# EAGLE design GCLora (EAGLE 6.3)
COMPANY: ADAFRUIT INDUSTRIES; DRAWN: KTOWN; REV: B
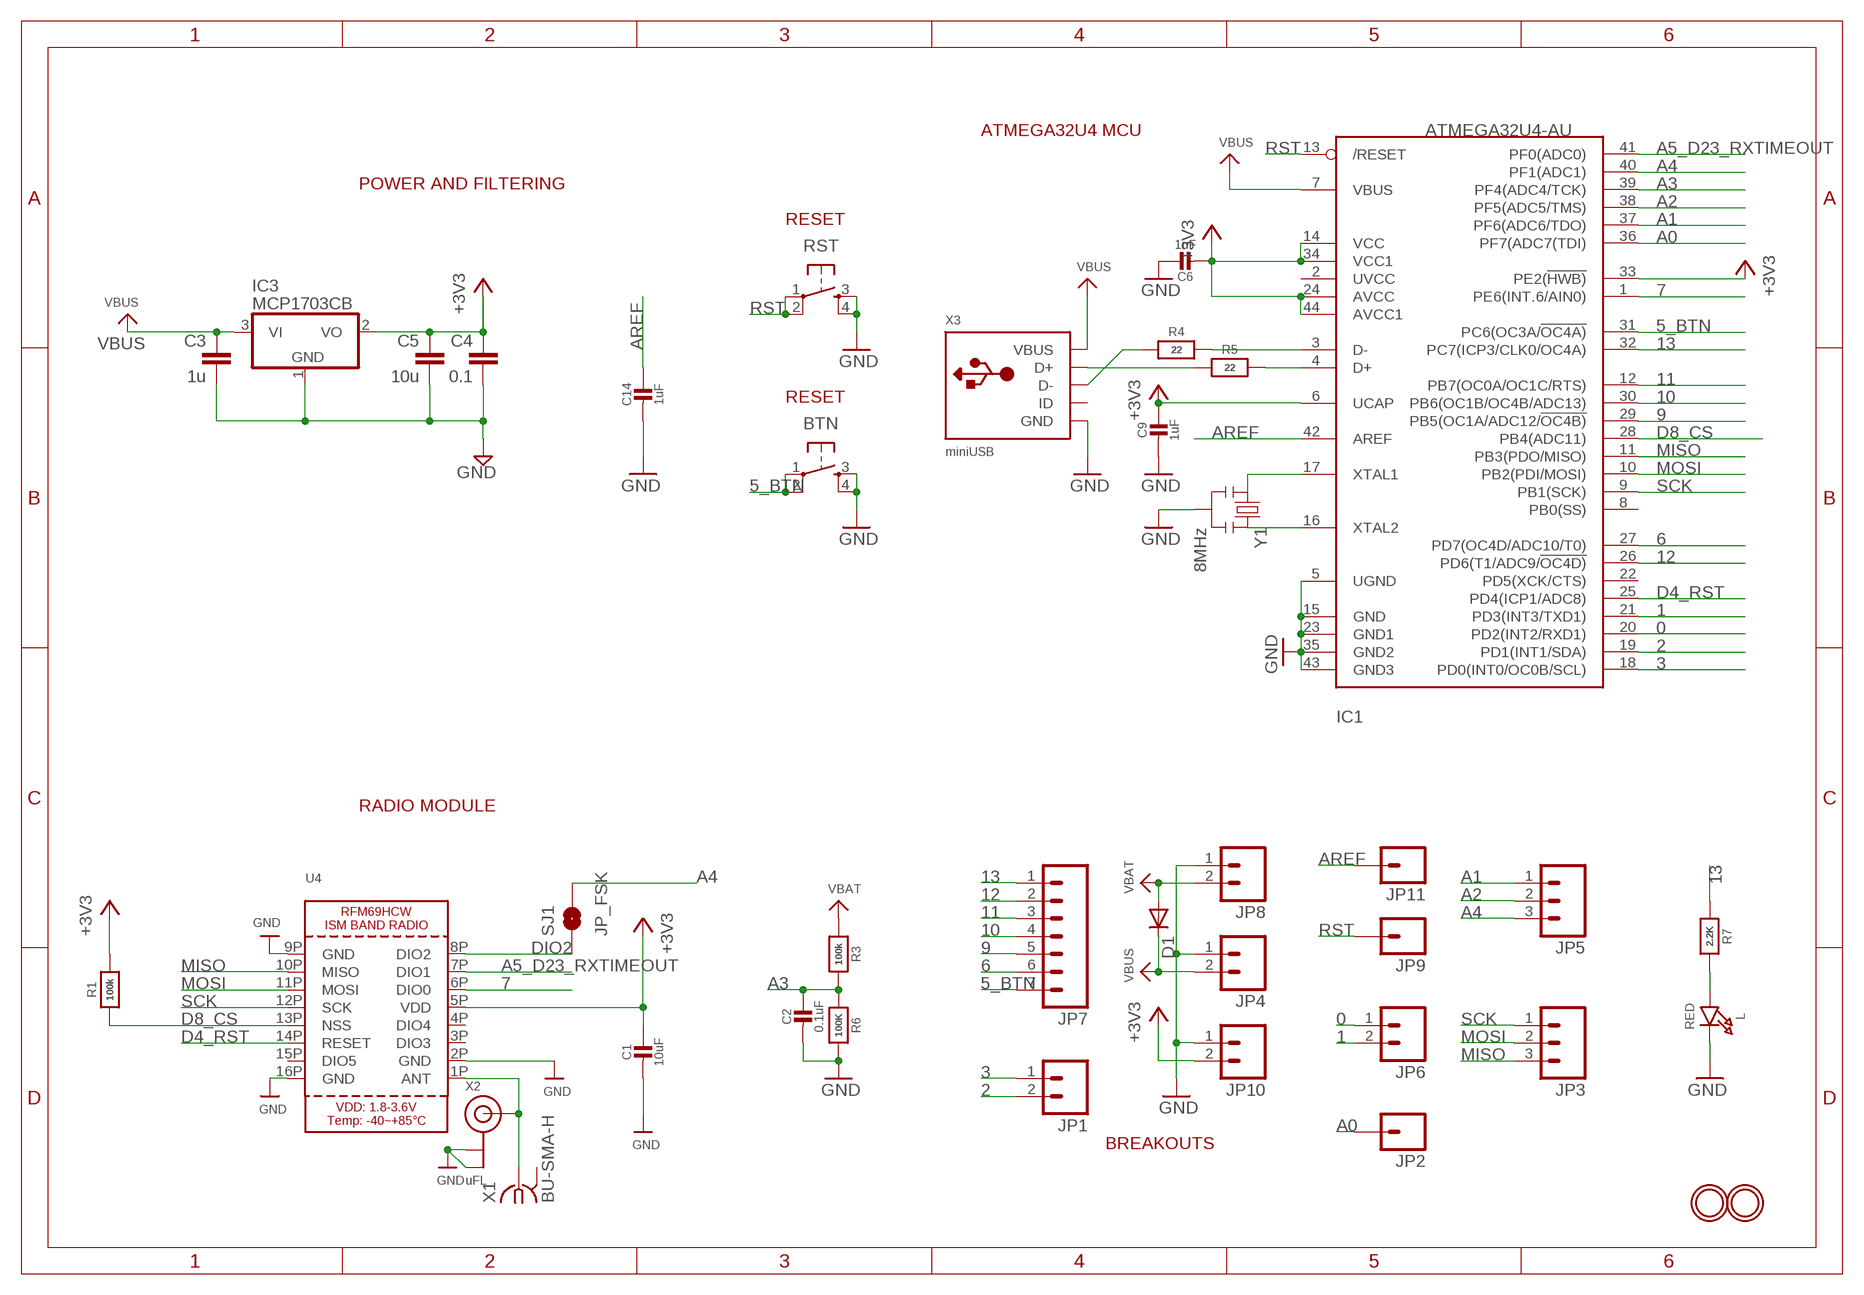
[diagram p0: schematic, sheet 1]

## Parts
BTN  TAC_SWITCHSMD  [TACTILE_SWITCH_SMD]
C1  10uF  CAP_CERAMIC0805-NOOUTLINE  [0805-NO]
C2  0.1uF  CAP_CERAMIC0805-NOOUTLINE  [0805-NO]
C3  1u  CAP0805  [0805]
C4  0.1  CAP0805  [0805]
C5  10u  CAP0805-CAP  [0805-CAP]
C6  1uF  CAP_CERAMIC0805-NOOUTLINE  [0805-NO]
C9  1uF  CAP_CERAMIC0805-NOOUTLINE  [0805-NO]
C14  1uF  CAP_CERAMIC0805-NOOUTLINE  [0805-NO]
D1  DIODESOD  [SOD-323]
IC1  ATMEGA32U4-AU  [TQFP44]
IC3  MCP1703CB  [SOT23]
JP1  M021X02_NO_SILK  [1X02_NO_SILK]
JP2  M01PTH_NO_SILK_YES_STOP  [1X01_NO_SILK]
JP3  M031X03_NO_SILK  [1X03_NO_SILK]
JP4  M021X02_NO_SILK  [1X02_NO_SILK]
JP5  M031X03_NO_SILK  [1X03_NO_SILK]
JP6  M021X02_NO_SILK  [1X02_NO_SILK]
JP7  M07  [1X07]
JP8  M021X02_NO_SILK  [1X02_NO_SILK]
JP9  M01PTH_NO_SILK_YES_STOP  [1X01_NO_SILK]
JP10  M021X02_NO_SILK  [1X02_NO_SILK]
JP11  M01PTH_NO_SILK_YES_STOP  [1X01_NO_SILK]
L  RED  LED0805_NOOUTLINE  [CHIPLED_0805_NOOUTLINE]
R1  100k  RESISTOR0805_NOOUTLINE  [0805-NO]
R3  100k  RESISTOR0805_NOOUTLINE  [0805-NO]
R4  22  RESISTOR0805_NOOUTLINE  [0805-NO]
R5  22  RESISTOR0805_NOOUTLINE  [0805-NO]
R6  100K  RESISTOR0805_NOOUTLINE  [0805-NO]
R7  2.2K  RESISTOR0805_NOOUTLINE  [0805-NO]
RST  TAC_SWITCHSMD  [TACTILE_SWITCH_SMD]
SJ1  JP_FSK  SPARKFUN-PASSIVES_SOLDERJUMPERNO  [SPARKFUN-PASSIVES_SJ_2S-NO]
U4  RFM69HCW_SMT  [RFMHCW_SMT]
U$31  MOUNTINGHOLE2.5  [MOUNTINGHOLE_2.5_PLATED]
U$32  MOUNTINGHOLE2.5  [MOUNTINGHOLE_2.5_PLATED]
X1  BU-SMA-H  [BU-SMA-H]
X2  uFL  ANTENNA_U.FL  [U.FL]
X3  miniUSB  USBMINIBLARGE  [USB-MINIB_LARGER]
Y1  8MHz  RESONATORSMD  [RESONATOR-SMD]

## Nets
0: IC1.20(PD2(INT2/RXD1)) JP6.1
1: IC1.21(PD3(INT3/TXD1)) JP6.2
2: IC1.19(PD1(INT1/SDA)) JP1.2
3: IC1.18(PD0(INT0/OC0B/SCL)) JP1.1
5_BTN: BTN.1 BTN.2 IC1.31(PC6(OC3A/!OC4A)) JP7.7
6: IC1.27(PD7(OC4D/ADC10/T0)) JP7.6
7: IC1.1(PE6(INT.6/AIN0)) U4.6P(DIO0)
9: IC1.29(PB5(OC1A/ADC12/!OC4B)) JP7.5
10: IC1.30(PB6(OC1B/OC4B/ADC13)) JP7.4
11: IC1.12(PB7(OC0A/OC1C/RTS)) JP7.3
12: IC1.26(PD6(T1/ADC9/!OC4D)) JP7.2
13: IC1.32(PC7(ICP3/CLK0/OC4A)) JP7.1 R7.1
+3V3: C1.1 C4.1 C5.1 C6.2 C9.1 IC1.6(UCAP) IC1.14(VCC) IC1.24(AVCC) IC1.33(PE2(!HWB)) IC1.34(VCC1) IC1.44(AVCC1) IC3.2(VO) JP10.2 R1.2 U4.5P(VDD)
A0: IC1.36(PF7(ADC7(TDI)) JP2.1
A1: IC1.37(PF6(ADC6/TDO)) JP5.1
A2: IC1.38(PF5(ADC5/TMS)) JP5.2
A3: C2.1 IC1.39(PF4(ADC4/TCK)) R3.2 R6.1
A4: IC1.40(PF1(ADC1)) JP5.3 SJ1.2
A5_D23_RXTIMEOUT: IC1.41(PF0(ADC0)) U4.7P(DIO1)
ANT: U4.1P(ANT) X1.1 X2.3(SIGNAL)
AREF: C14.1 IC1.42(AREF) JP11.1
D4_RST: IC1.25(PD4(ICP1/ADC8)) U4.14P(RESET)
D8_CS: IC1.28(PB4(ADC11)) R1.1 U4.13P(NSS)
D+: IC1.4(D+) R5.2
D-: IC1.3(D-) R4.2
DIO2: SJ1.1 U4.8P(DIO2)
GND: BTN.3 BTN.4 C1.2 C2.2 C3.2 C4.2 C5.2 C6.1 C9.2 C14.2 IC1.5(UGND) IC1.15(GND) IC1.23(GND1) IC1.35(GND2) IC1.43(GND3) IC3.1(GND) JP4.1 JP8.1 JP10.1 L.C R6.2 RST.3 RST.4 U4.2P(GND) U4.9P(GND) U4.16P(GND) X2.1(GND) X2.2(GND) X3.GND X3.GND1(GND) X3.GND2(GND) X3.GND3(GND) X3.GND4(GND) Y1.2
MISO: IC1.11(PB3(PDO/MISO)) JP3.3 U4.10P(MISO)
MOSI: IC1.10(PB2(PDI/MOSI)) JP3.2 U4.11P(MOSI)
N$2: L.A R7.2
N$11: IC1.16(XTAL2) Y1.3
N$12: IC1.17(XTAL1) Y1.1
N$15: R5.1 X3.D+
N$16: R4.1 X3.D-
RST: IC1.13(/RESET) JP9.1 RST.1 RST.2
SCK: IC1.9(PB1(SCK)) JP3.1 U4.12P(SCK)
VBAT: D1.2(A) JP8.2 R3.1
VBUS: C3.1 D1.1(C) IC1.7(VBUS) IC3.3(VI) JP4.2 X3.VBUS
Unconnected: IC1.2(UVCC) IC1.8(PB0(SS)) IC1.22(PD5(XCK/CTS)) U4.3P(DIO3) U4.4P(DIO4) U4.15P(DIO5) X3.ID

## Notes on the sheet
- ATMEGA32U4 MCU
- POWER AND FILTERING
- RESET
- RESET
- RADIO MODULE
- BREAKOUTS

## Power pins joined to a net without a drawn wire
GND: X1.2(GND) X1.3(GND) X1.4(GND) X1.5(GND)

## Library data of the parts
BTN RST = SparkFun-Electromechanical:TAC_SWITCH: Momentary Switch Button commonly used for reset or general input. Spark Fun Electronics SKU : COM-00097 SMT- SWCH-08247; PROD_ID: SWCH-08247
C1 C2 C6 C9 C14 = microbuilder:CAP_CERAMIC: Ceramic Capacitors For new designs, use the packages preceded by an '_' character since they are more reliable: The following footprints should be used on most boards: _0402 - Standard footprint for regular board layouts _0603 - Standard footprint for regular board layouts _0805 - Standard footprint for regular board layouts _1206 - Standard footprint for regular board layouts For extremely tight-pitch boards where space is at a premium, the following 'micro-pitch' footprints can be used (smaller pads, no silkscreen outline, etc.): _0402MP - Micro-pitch footprint for very dense/compact boards _0603MP - Micro-pitch footprint for very dense/compact boards _0805MP - Micro-pitch footprint for very dense/compact boards _1206MP - Micro-pitch footprint for very dense/compact boards
C3-C5 = LowPowerLab:CAP: Capacitor Standard 0603 ceramic capacitor, and 0.1" leaded capacitor.
D1 = SparkFun-DiscreteSemi:DIODE: Diode These are standard reverse protection diodes and small signal diodes. SMA package can handle up to about 1A. SOD-323 can handle about 200mA. What the SOD-323 package when ordering, there are some mfgs out there that are 5-pin packages.
IC1 = microbuilder:ATMEGA32U4: http://www.ladyada.net/library/eagle
IC3 = linear:MCP1703: 250 mA, 16V, Low Quiescent Current LDO Regulator Source: http://ww1.microchip.com/downloads/en/DeviceDoc/22049b.pdf
JP1 JP4 JP6 JP8 JP10 = SparkFun-Connectors:M02: Standard 2-pin 0.1" header. Use with - straight break away headers ( PRT-00116) - right angle break away headers (PRT-00553) - swiss pins (PRT-00743) - machine pins (PRT-00117) - female headers (PRT-00115) Molex polarized connector foot print use with: PRT-08233 with associated crimp pins and housings. 2.54_SCREWTERM for use with PRT-10571. 3.5mm Screw Terminal footprints for PRT-08084 5mm Screw Terminal footprints for use with PRT-08432
JP2 JP9 JP11 = SparkFun-Connectors:M01: Header 1 Standard 1-pin 0.1" header. Use with straight break away headers (SKU : PRT-00116), right angle break away headers (PRT-00553), swiss pins (PRT-00743), machine pins (PRT-00117), and female headers (PRT-00115).
JP3 JP5 = SparkFun-Connectors:M03: Header 3 Standard 3-pin 0.1" header. Use with straight break away headers (SKU : PRT-00116), right angle break away headers (PRT-00553), swiss pins (PRT-00743), machine pins (PRT-00117), and female headers (PRT-00115). Molex polarized connector foot print use with SKU : PRT-08232 with associated crimp pins and housings.
JP7 = SparkFun-Connectors:M07: Header 7 Standard 7-pin 0.1" header. Use with straight break away headers (SKU : PRT-00116), right angle break away headers (PRT-00553), swiss pins (PRT-00743), machine pins (PRT-00117), and female headers (PRT-00115). NOTES ON THE VARIANTS LOCK and LOCK_LONGPADS... This footprint was designed to help hold the alignment of a through-hole component (i.e. 7-pin header) while soldering it into place. You may notice that each hole has been shifted either up or down by 0.005 of an inch from it's more standard position (which is usually a perfectly straight line). This slight alteration caused the pins (the squares in the middle) to touch the edges of the holes. Because they are alternating, it causes a "brace" to hold the header in place. 0.005 has proven to be the perfect amount of "off-center" position when using our standard breakaway headers. Although looks a little odd when you look at the bare footprint, once you have a header in there, the alteration is very hard to notice. Also, if you push a header all the way into place, it is covered up entirely on the bottom side. This idea of altering the position of holes to aid alignment will be further integrated into the Sparkfun Library for other footprints. It can help hold any component with 3 or more connection pins.
L = microbuilder:LED: LED 0603 - 0603 Surface Mount Package 2mA: Green LED - Low Power (3.9mcd, 2ma, 1.7Vf) - Digikey: 475-2709-2-ND Orange LED - Low Power (9.8mcd, 2ma, 1.8Vf) - Digikey: 475-1194-2-ND Red LED - Low Power (5mcd, 2ma, 1.8Vf) - Digikey: 475-1195-2-ND Yellow LED - Low Power (7mcd, 2ma, 1.8Vf) - Digikey: 475-1196-2-ND 5mA: Blue LED - Low Power (17mcd, 5ma, 2.9Vf) - Digikey: LNJ937W8CRACT-ND 0805 - 0805 Surface Mount Package 2mA: Red LED (8.8mcd, 2mA, 1.8Vf, Clear) - Low Power [Digikey: 475-2510-1-ND] Green LED (5mcd, 2mA, 1.8Vf, Clear) - Low Power [Digikey: 475-2730-1-ND] Yellow LED (11.3mcd, 2mA, 1.8Vf, Clear) - Low Power [Digikey: 475-2555-1-ND] 20mA: Red LED (104mcd, 20mA, Diffused) - LS R976 [Digikey: 475-1278-6-ND] Red LED (12mcd, 20mA, 2.0Vf, Clear) - APT2012EC [Digikey: 754-1128-1-ND] Green LED (15mcd, 20mA, 2.2Vf, Clear) - APT2012GC [Digikey: 754-1131-1-ND] Orange LED (160mcd, 20mA, 2.1Vf, Clear) - APT2012SECK [Digikey: 754-1130-1-ND] 1206 - 1206 Surface Mount Package Green LED (26mcd, 20mA, Diffused) - LG N971 [Digikey: 475-1407-6-ND] Red LED (15mcd, 20mA, Diffused) - LH N974 [Digikey: 475-1416-6-ND] Cree - Cree High-Power Surface Mount LEDs XPEBWT-L1-0000-00D50 - White 111lm 350mA 2.9Vf 6200K 110° XTEAWT-00-0000-00000LEE3 - White 114lm 350mA 2.85Vf 5000K 115° Everlight - Everlight 45-21 Series Surface Mount LEDs 45-21/QK2C-B2832AC2CB2/2T - Warm White 2000mcd 20mA 3.25Vf 3050K 120° 45-21/LK2C-B38452C4CB2/2T - Nuetral White 2000mcd 20mA 3.25Vf 4150K 120° 45-21/LK2C-B50634C6CB2/2T - Cold White 2200mcd 20mA 3.25Vf 5650K 120° PLCC2 Reverse Mount LS T77K-J1L2-1-0-2-R18-Z - Red 11.25mcd 2mA 1.8Vf 630nm 120° LO T77K-L1M2-24-Z - Orange 19.6mcd 2mA 1.8Vf 606nm 120° LY T77K-K2M1-26-Z - Yellow 15.7mcd 2mA 1.8Vf 587nm 120°
R1 R3-R7 = microbuilder:RESISTOR: Resistors For new designs, use the packages preceded by an '_' character since they are more reliable: The following footprints should be used on most boards: _0402 - Standard footprint for regular board layouts _0603 - Standard footprint for regular board layouts _0805 - Standard footprint for regular board layouts _1206 - Standard footprint for regular board layouts For extremely tight-pitch boards where space is at a premium, the following 'micro-pitch' footprints can be used (smaller pads, no silkscreen outline, etc.): _0402MP - Micro-pitch footprint for very dense/compact boards _0603MP - Micro-pitch footprint for very dense/compact boards _0805MP - Micro-pitch footprint for very dense/compact boards _1206MP - Micro-pitch footprint for very dense/compact boards
SJ1 = tempLED_GARAGE_BOX:SPARKFUN-PASSIVES_SOLDERJUMPER: Solder Jumper Standard SMD solder jumper. Used to automate production. Two varients : Normally Open and Normally Closed are the same, but have different paste layers. NC will have a large amount of paste and should jumper during reflow.
U4 = microbuilder:RFM69HCW: RFM69HCW - ISM Band RF Transceiver
U$31 U$32 = microbuilder:MOUNTINGHOLE: Mounting Hole For #2 screws (0.086"/2.18mm width, 0.094"/2.4mm hole) use 2.5mm; BOM: EXCLUDE
X1 = con-coax:BU-SMA-H: FEMALE SMA CONNECTOR Radiall; OC_FARNELL: unknown; OC_NEWARK: unknown
X2 = microbuilder:ANTENNA_U.FL: U.FL Antenna Connector
X3 = microbuilder:USB: USB Connectors USBMINIB - Surface Mount Female Mini-B USB Connector 4UConnector: 06564
Y1 = SparkFun:RESONATOR: Resonator Small SMD resonator. This is the itty bitty 10/20MHz resonators with built in caps. CSTCE10M0G55 and CSTCE20M0V53. Footprint has been reviewed closely but hasn't been tested yet.

## Net classes
1 power: width 0.381 mm, clearance 0.254 mm

## Board
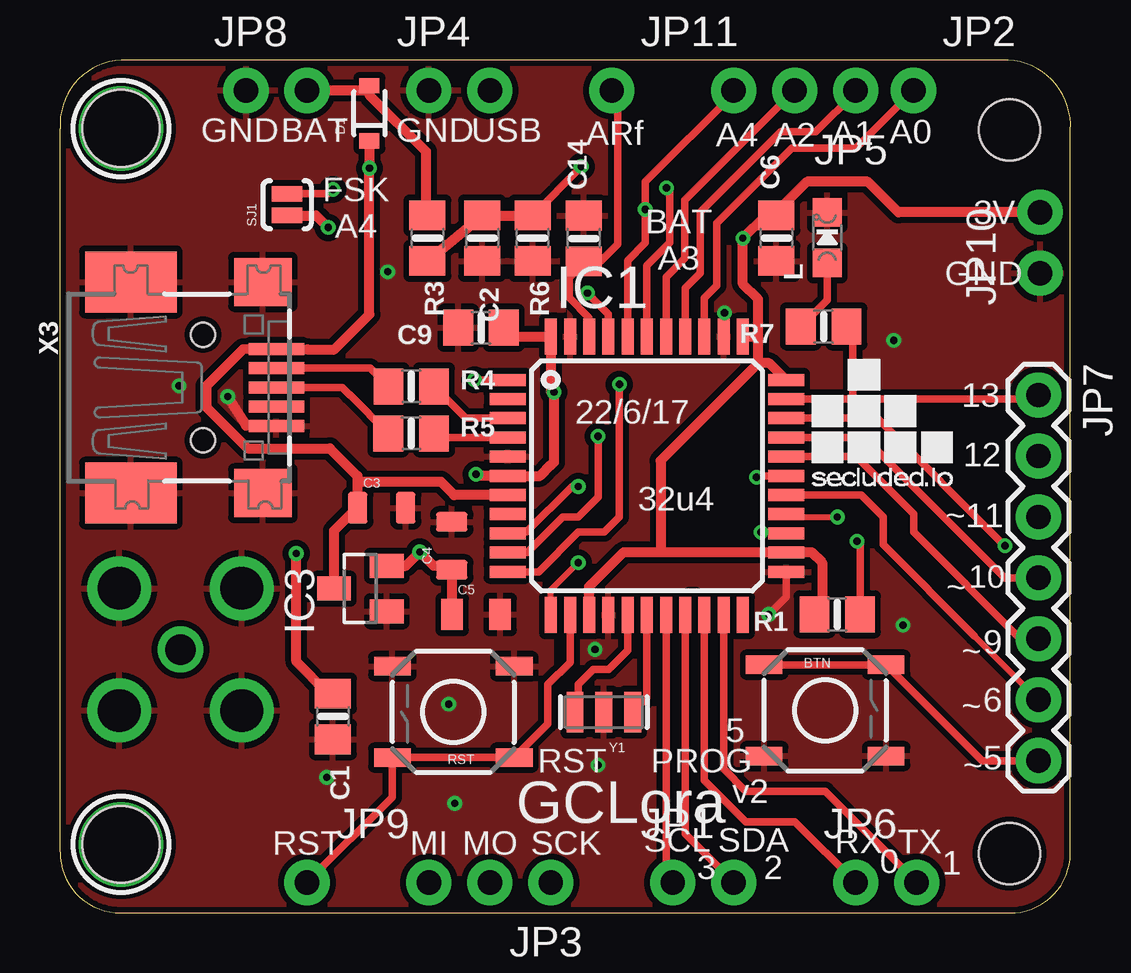
[diagram p1: board, top side]
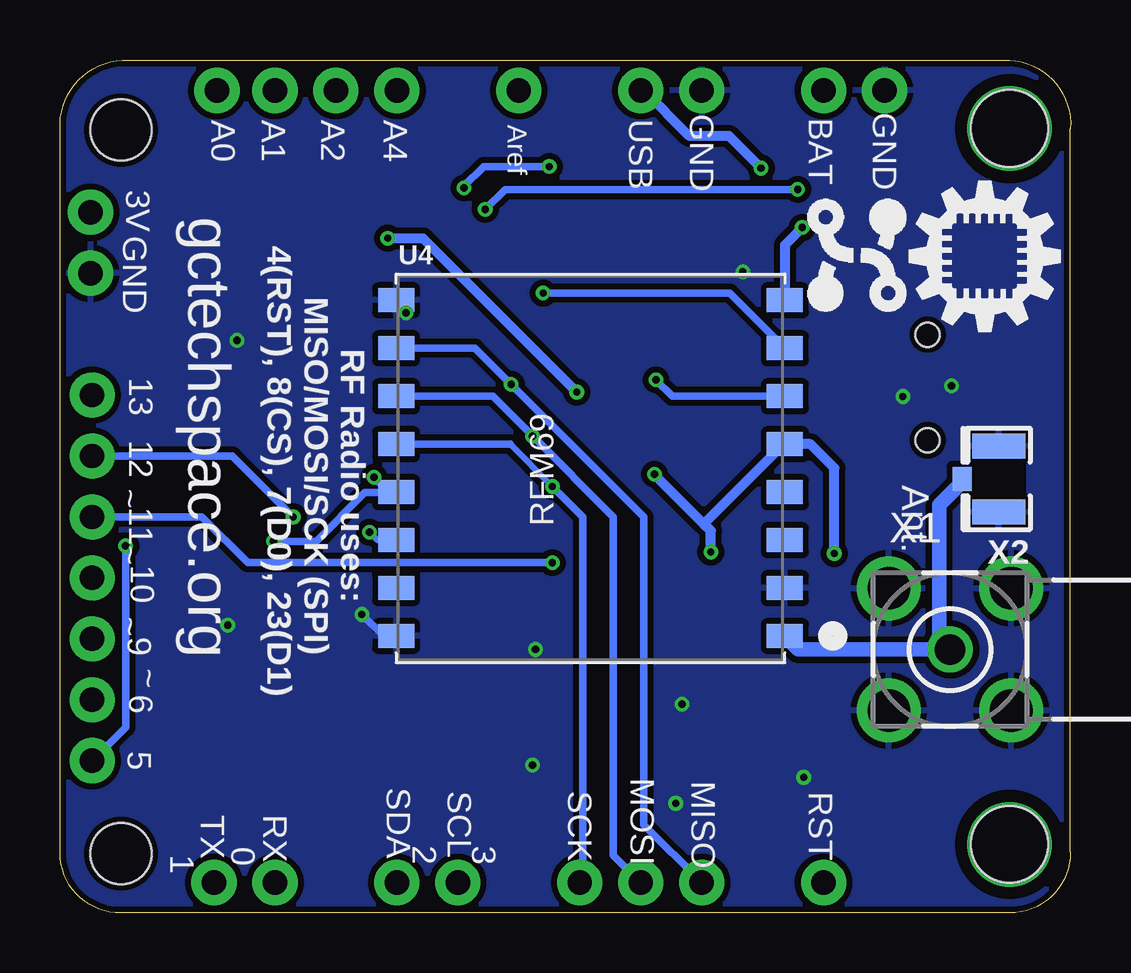
[diagram p2: board, bottom side, seen from below]

Size 42.11 x 35.56 mm. Coordinates in mm from the lower left corner, seen from the top.
Outline: 2.54,0 39.56,0 arc90 42.1,2.48 42.1,32.64 arc90 39.5,35.56 2.54,35.56 arc90 0,32.7 0,2.54 arc90 2.54,0
Copper layers (1*16): Top 0.035mm / dielectric 1.5mm / Bottom 0.035mm
Design rules "dirt_cheap_dirty_boards.v1": minimum track width 5mil, minimum drill 12mil, track to track 5mil, track to pad 5mil, pad to pad 5mil, via to via 5mil, smd to smd 0mil, copper to edge 10mil, drill to drill 10mil, minimum pad ring 10mil, minimum via ring 6mil, stop-mask expansion 2mil, vias tented up to drill 25mil, thermal gap 10mil
Holes 2.54 mm at 39.56,32.64 39.56,2.48
Holes 3.2 mm at 2.54,2.86 2.54,32.7
tRestrict: area 20.8,9.3 to 21.1,12.8; area 20.7,8.1 to 22.9,8.5; area 26.2,10.3 to 26.5,13.3

### Footprints (pad centres in the part's own frame; a part is rotated, then mirrored left to right if it is on the bottom)
TACTILE_SWITCH_SMD = smd 1.524 x 0.762: 1 -2.54,1.905; 2 2.54,1.905; 3 -2.54,-1.905; 4 2.54,-1.905
0805-NO = smd 1.24 x 1.5: 1 -0.95,0; 2 0.95,0
0805 = smd 0.8 x 1.3: 1 -1,0; 2 1,0
0805-CAP = smd 0.902 x 1.3: 1 -1,0; 2 1,0
SOD-323 = smd 0.63 x 0.83: 1 -1.15,0; 2 1.15,0
TQFP44 = smd 1.5 x 0.5: 1 -5.8,4; 2 -5.8,3.2; 3 -5.8,2.4; 4 -5.8,1.6; 5 -5.8,0.8; 6 -5.8,0; 7 -5.8,-0.8; 8 -5.8,-1.6; 9 -5.8,-2.4; 10 -5.8,-3.2; 11 -5.8,-4; 23 5.8,-4; 24 5.8,-3.2; 25 5.8,-2.4; 26 5.8,-1.6; 27 5.8,-0.8; 28 5.8,0; 29 5.8,0.8; 30 5.8,1.6; 31 5.8,2.4; 32 5.8,3.2; 33 5.8,4 | smd 0.5 x 1.5: 12 -4,-5.8; 13 -3.2,-5.8; 14 -2.4,-5.8; 15 -1.6,-5.8; 16 -0.8,-5.8; 17 0,-5.8; 18 0.8,-5.8; 19 1.6,-5.8; 20 2.4,-5.8; 21 3.2,-5.8; 22 4,-5.8; 34 4,5.8; 35 3.2,5.8; 36 2.4,5.8; 37 1.6,5.8; 38 0.8,5.8; 39 0,5.8; 40 -0.8,5.8; 41 -1.6,5.8; 42 -2.4,5.8; 43 -3.2,5.8; 44 -4,5.8
SOT23 = smd 1 x 1.4: 1 -0.95,-1.1; 2 0.95,-1.1; 3 0,1.1
1X02_NO_SILK = drill 1.016 pad 1.88: 1 0,0; 2 2.54,0
1X01_NO_SILK = drill 1.016 pad 1.88: 1 0,0
1X03_NO_SILK = drill 1.016 pad 1.88: 1 0,0; 2 2.54,0; 3 5.08,0
1X07 = drill 1.016 pad 1.88: 1 0,0; 2 2.54,0; 3 5.08,0; 4 7.62,0; 5 10.16,0; 6 12.7,0; 7 15.24,0
CHIPLED_0805_NOOUTLINE = smd 1.2 x 1.2: A 0,-1.05; C 0,1.05
SPARKFUN-PASSIVES_SJ_2S-NO = smd 0.635 x 1.27: 1 -0.45,0; 2 0.45,0
RFMHCW_SMT = smd 1.5 x 1: 1P 8.1,-7; 2P 8.1,-5; 3P 8.1,-3; 4P 8.1,-1; 5P 8.1,1; 6P 8.1,3; 7P 8.1,5; 8P 8.1,7; 9P -8.1,7; 10P -8.1,5; 11P -8.1,3; 12P -8.1,1; 13P -8.1,-1; 14P -8.1,-3; 15P -8.1,-5; 16P -8.1,-7
MOUNTINGHOLE_2.5_PLATED = drill 2.5 pad 3.2: P$1 0,0
BU-SMA-H = drill 1.27: 1 0,0 | drill 1.778: 2 -2.55,2.55; 3 2.55,2.55; 4 2.55,-2.55; 5 -2.55,-2.55
U.FL = smd 2.2 x 1.05: 1 0,1.375; 2 0,-1.375 | smd 0.8 x 1: 3 1.525,0
USB-MINIB_LARGER = smd 0.5 x 2.308: D+ 0,4.064; D- -0.8,4.064; GND 1.6,4.064; ID 0.8,4.064; VBUS -1.6,4.064 | smd 2.54 x 3.81: GND1 -4.4,-2; GND4 4.4,-2 | smd 2 x 2.4: GND2 -4.4,3.5; GND3 4.4,3.5 | hole 1: -2.2,1; 2.2,1
RESONATOR-SMD = smd 0.7 x 1.7: 1 -1.2,0; 2 0,0; 3 1.2,0

### Placement (x,y rotation side)
BTN  31.88,8.45 0 top
C1  11.37,8.19 270 top
C2  17.59,28.13 270 top
C3  13.4,16.89 0 top
C4  16.32,15.3 90 top
C5  17.34,12.45 0 top
C6  29.85,28.13 90 top
C9  17.54,24.4 180 top
C14  21.82,28.12 90 top
D1  12.89,33.34 90 top
IC1  24.45,18.22 0 top
IC3  12.51,13.53 90 top
JP1  25.53,1.27 0 top
JP2  35.56,34.29 0 top
JP3  20.45,1.27 180 top
JP4  15.37,34.29 0 top
JP5  33.15,34.29 180 top
JP6  33.15,1.27 0 top
JP7  40.77,21.59 270 top
JP8  7.75,34.29 0 top
JP9  10.29,1.27 0 top
JP10  40.83,26.67 90 top
JP11  22.99,34.29 0 top
L  31.97,28.15 0 top
R1  32.39,12.45 180 top
R3  15.31,28.13 270 top
R4  14.64,21.95 0 top
R5  14.63,19.99 0 top
R6  19.69,28.13 270 top
R7  31.82,24.45 180 top
RST  16.39,8.38 180 top
SJ1  9.46,29.53 90 top
U4  20.01,18.54 0 bottom
U$6  [ESPDUINO_LOGO_5MM]  8.92,27.43 270 bottom
U$7  [SECLUDED_5MM]  31.25,17.68 0 top
U$15  [ID_LOGO_X0.25]  6.8,24.1 0 bottom
U$31  2.54,32.7 270 top
U$32  2.54,2.86 270 top
X1  5.02,10.99 0 bottom
X2  2.99,18.1 180 bottom
X3  4.96,21.91 270 top
Y1  22.66,8.37 180 top

### Tracks (layer width: path | path; a pad name or v marks a point on that pad's centre or on a via)
0
  Top 0.305: IC1.20 26.85,5.54 28.58,3.81 30.61,3.81 JP6.1
1
  Top 0.305: IC1.21 27.65,6.01 28.58,5.08 31.88,5.08 JP6.2
2
  Top 0.305: IC1.19 26.05,3.29 JP1.2
3
  Top 0.305: IC1.18 25.25,1.55 JP1.1
5_BTN  (via drill 0.3)
  Top 0.305: JP7.7 38.42,6.35 BTN.2 BTN.1 | IC1.31 34.05,20.62 v39.37,15.3
  Bottom 0.305: v39.37,15.3 39.37,7.75 JP7.7
6
  Top 0.254: 38.1,11.56 JP7.6
  Top 0.305: IC1.27 33.38,17.42 34.29,16.51 34.29,15.37 38.1,11.56
7  (via drill 0.3)
  Top 0.305: IC1.1 v17.28,22.23
  Bottom 0.305: v17.28,22.23 16.59,21.54 U4.6P
9
  Top 0.305: IC1.29 33.18,19.02 35.56,16.64 35.56,15.88 40.01,11.43 JP7.5
10
  Top 0.305: IC1.30 33.52,19.82 39.37,13.97 JP7.4
11  (via drill 0.3)
  Top 0.254: IC1.12 20.45,13.46 v21.59,14.61
  Bottom 0.305: v21.59,14.61 34.29,14.61 36.2,16.51 JP7.3
12  (via drill 0.3)
  Top 0.254: IC1.26 30.37,16.51 v32.39,16.51
  Bottom 0.305: JP7.2 34.93,19.05 v32.39,16.51
13
  Top 0.254: 40.61,21.42 JP7.1
  Top 0.305: IC1.32 33.02,21.42 | 33.02,21.42 40.61,21.42 | R7.1 33.02,24.19 33.02,21.42
+3V3  (via drill 0.3)
  Top 0.406: v17.34,18.29 17.34,18.22 IC1.6 20.01,18.22 20.45,18.67 20.58,18.8 v20.58,21.72 20.45,21.72 IC1.44 18.87,24.02 C9.1 | IC1.14 22.05,13.6 23.5,15.05 25.02,15.05 | 25.02,15.05 30.23,15.05 IC1.24 30.28,15.05 31.31,15.05 31.75,14.61 31.75,12.76 R1.2 | 29.09,22.92 25.02,18.86 25.02,15.05 | IC1.33 29.55,22.92 29.09,22.92 | JP10.2 40.7,29.08 40.58,29.21 34.93,29.21 33.66,30.48 31.12,30.48 29.85,29.21 C6.2 29.4,29.08 v28.45,28.13 | 29.09,22.92 29.09,24.13 | 29.09,24.13 29.09,25.59 28.45,26.23 v28.45,28.13 | v28.45,28.13 | IC1.34 28.98,24.02 29.09,24.13 | C5.1 16.32,12.46 C4.1 16.15,14.48 15.56,14.48 v14.99,15.05 14.42,14.48 IC3.2 | C1.1 11.18,9.14 9.85,10.48 v9.85,14.99
  Bottom 0.406: v28.45,28.13 26.99,28.13 v20.58,21.72 | v14.99,15.05 14.99,15.94 15.28,16.22 | 15.28,16.22 v17.34,18.29 | v9.85,14.99 9.85,18.54 10.85,19.54 U4.5P 11.96,19.54 15.28,16.22
A0
  Top 0.305: IC1.36 26.85,25.64 27.37,26.16 27.37,28.77 30.48,31.88 33.15,31.88 JP2.1
A1
  Top 0.305: IC1.37 26.05,26.05 26.67,26.67 26.67,29.21 30.04,32.58 31.5,32.58 33.15,34.23 JP5.1
A2
  Top 0.305: IC1.38 25.25,26.52 26.04,27.3 26.04,29.72 JP5.2
A3  (via drill 0.3)
  Top 0.305: R6.1 v21.72,31.11 | IC1.39 24.45,26.99 25.4,27.94 25.4,30.1 v25.28,30.23
  Top 0.406: R3.2 C2.1 R6.1
  Bottom 0.305: v21.72,31.11 24.45,31.11 25.28,30.29 v25.28,30.23
A4  (via drill 0.3)
  Top 0.305: SJ1.2 11.18,29.98 v11.37,30.16 | IC1.40 23.65,27.2 24.39,27.94 v24.39,29.34 24.39,30.48 28.07,34.16 JP5.3
  Bottom 0.305: v11.37,30.16 23.56,30.16 v24.39,29.34
A5_D23_RXTIMEOUT  (via drill 0.3)
  Top 0.305: IC1.41 22.85,24.97 v21.97,25.84
  Bottom 0.305: v21.97,25.84 14.21,25.84 U4.7P
ANT
  Bottom 0.61: U4.1P 11.35,10.99 X1.1 5.46,11.43 5.46,17.02 4.51,17.97 X2.3
AREF
  Top 0.305: IC1.42 22.04,24.04 22.04,24.83 21.21,25.65 21.21,26.48 21.82,27.09 C14.1 22.54,27.17 23.24,27.88 23.24,34.04 JP11.1
D4_RST  (via drill 0.3)
  Top 0.254: IC1.25 30.2,15.88 v29.21,15.88
  Bottom 0.254: v29.21,15.88 28.88,15.54 U4.14P
D8_CS  (via drill 0.3)
  Top 0.305: R1.1 33.34,15.37 v33.21,15.49 | IC1.28 29.09,18.22 v29.02,18.16
  Bottom 0.305: v33.21,15.49 31.44,15.49 29.4,17.53 28.12,17.53 U4.13P 28.4,17.54 v29.02,18.16
D+
  Top 0.305: IC1.4 15.92,19.82 R5.2
D-
  Top 0.305: IC1.3 16.91,20.62 R4.2
DIO2  (via drill 0.3)
  Top 0.406: SJ1.1 10.68,29.08 v11.18,28.57
  Bottom 0.406: v11.18,28.57 11.91,27.85 U4.8P
GND  (via drill 0.3)
  Top 0.305: IC1.23 30.25,13.17 v29.53,12.45 | IC1.35 27.65,24.92 v27.69,25.02
  Top 0.406: X3.GND 9.1,20.31 7.75,20.32 v6.99,21.53
  Bottom 0.305: v29.53,12.45 28.63,11.54 U4.16P | v27.69,25.02 27.75,25.19 U4.9P
  other vias: 13.66,26.73 22.29,10.99 22.42,6.16 4.96,21.97 11.12,5.65 34.74,23.88 35.12,12 16.2,8.7 16.45,4.57
  pour Top (isolate 0.254): 0,35.56 0,0 42.1,0.06 42.1,35.56
  pour Bottom (isolate 0.254): 0,0 42.1,0.06 42.1,35.56 0,35.56
MISO  (via drill 0.3)
  Top 0.305: v23.31,22.04 23.31,16.51 22.67,15.88 21.59,15.88 19.94,14.22 IC1.11
  Bottom 0.305: U4.10P 24.82,23.54 v23.31,22.04 17.78,16.51 17.78,3.68 JP3.3
MOSI  (via drill 0.3)
  Top 0.305: v22.42,19.88 22.42,17.34 21.59,16.51 20.96,16.51 19.47,15.02 IC1.10
  Bottom 0.305: U4.11P 24.09,21.54 v22.42,19.88 19.05,16.51 19.05,2.41 JP3.2
N$2
  Top 0.305: R7.2 31.97,25.55 L.A
N$11
  Top 0.254: 21.59,8.5 Y1.3
  Top 0.305: IC1.16 23.65,10.95 22.86,10.16 22.23,10.16 21.59,9.53 21.59,8.5
N$12
  Top 0.305: IC1.17 24.45,8.96 Y1.1
N$15
  Top 0.305: X3.D+ 11.75,21.91 12.07,21.59 12.07,21.6 R5.1
N$16
  Top 0.305: X3.D- 12.93,22.71 R4.1
RST
  Top 0.305: IC1.13 21.25,10.45 20.32,9.53 20.32,7.87 RST.1 RST.2 13.85,4.83 JP9.1
SCK  (via drill 0.3)
  Top 0.254: 18.7,15.88 IC1.9
  Top 0.305: 18.7,15.88 19.43,15.88 21.34,17.78 v21.59,17.78
  Bottom 0.254: 20.32,1.4 JP3.1 | 23.36,19.54 v21.59,17.78
  Bottom 0.305: U4.12P 23.36,19.54 | 20.32,1.4 20.32,16.51 v21.59,17.78
VBAT
  Top 0.406: JP8.2 12.7,34.29 D1.2 12.89,34.1 15.24,31.75 15.24,29.14 R3.1
VBUS  (via drill 0.3)
  Top 0.406: 12.39,18.03 12.39,18.22 11.24,19.37 7.81,19.37 6.1,21.08 6.1,21.97 7.62,23.5 8.89,23.51 X3.VBUS 10.3,23.5 11.43,23.5 12.89,24.96 v12.89,31.05 D1.1 | 12.39,18.03 12.39,16.91 | 12.39,16.91 C3.1 | 12.39,16.91 11.41,15.93 IC3.3 | IC1.7 16.42,17.42 15.88,17.97 12.45,17.97 12.39,18.03
  Bottom 0.406: v12.89,31.05 14.23,32.38 15.88,32.38 17.78,34.29 JP4.2

### Text on the board
tPlace: GND | BAT | GND | USB | ARf | A1 | A0 | A4 | A2 | FSK / A4 | 3V | BAT / A3 | GND | 13 | 22/6/17 | 12 | 32u4 | ~11 | ~ | 10 | ~ | 9 | ~ | 6 | 5 | RST | PROG | GCLora | ~ | 5 | v2 | RST | MI | MO | SCK | SCL | SDA | RX | TX | 3 | 2 | 0 | 1
bPlace: GND | BAT | GND | USB | Aref | A4 | A2 | A1 | A0 | gctechspace.org | 3V | GND | 13 | 12 | Ant. | RFM69 | RF Radio uses: / MISO/MOSI/SCK (SPI) / 4(RST), 8(CS), 7(D0), 23(D1) | ~ | 11 | ~ | 10 | ~ | 9 | ~ | 6 | 5 | RST | MISO | MOSI | SCK | SCL | SDA | RX | TX | 3 | 2 | 0 | 1